# Altium schematic sheet CAN Termination.SchDoc
size A
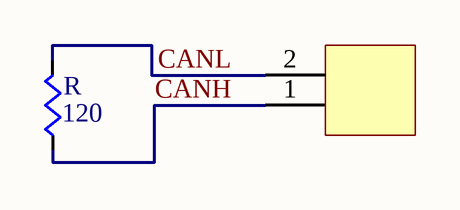
[diagram p0: CAN Termination.SchDoc]

## Parts
?  2-pin Horz Sherlock  [MOLEX-HDR-1X2-SHERLOCK-HORZ]  (value not drawn)
R  value 120  [RES0603]  (hidden comment: Res)

## Nets
CANH: ?.1 R.2(B)
CANL: ?.2 R.1(A)

## Library data of the parts
? = MOLEX-HDR-1x2-SHERLOCK_RA: Header, Molex, 2mm Pitch Sherlock Header, Single Row, Horizontal, 2 Circuits, Length 3.3mm,  0353630260; Manufacturer: Molex Inc; Manufacturer Part Number: 0353630260; Supplier Part Number 1: WM18931-ND; Supplier 1: Digi-Key
R = Res: Supplier 1: Digi-Key; Supplier Part Number 1: RMCF0603JT10K0CT-ND